# EAGLE design top_connector (EAGLE 9.7.0)
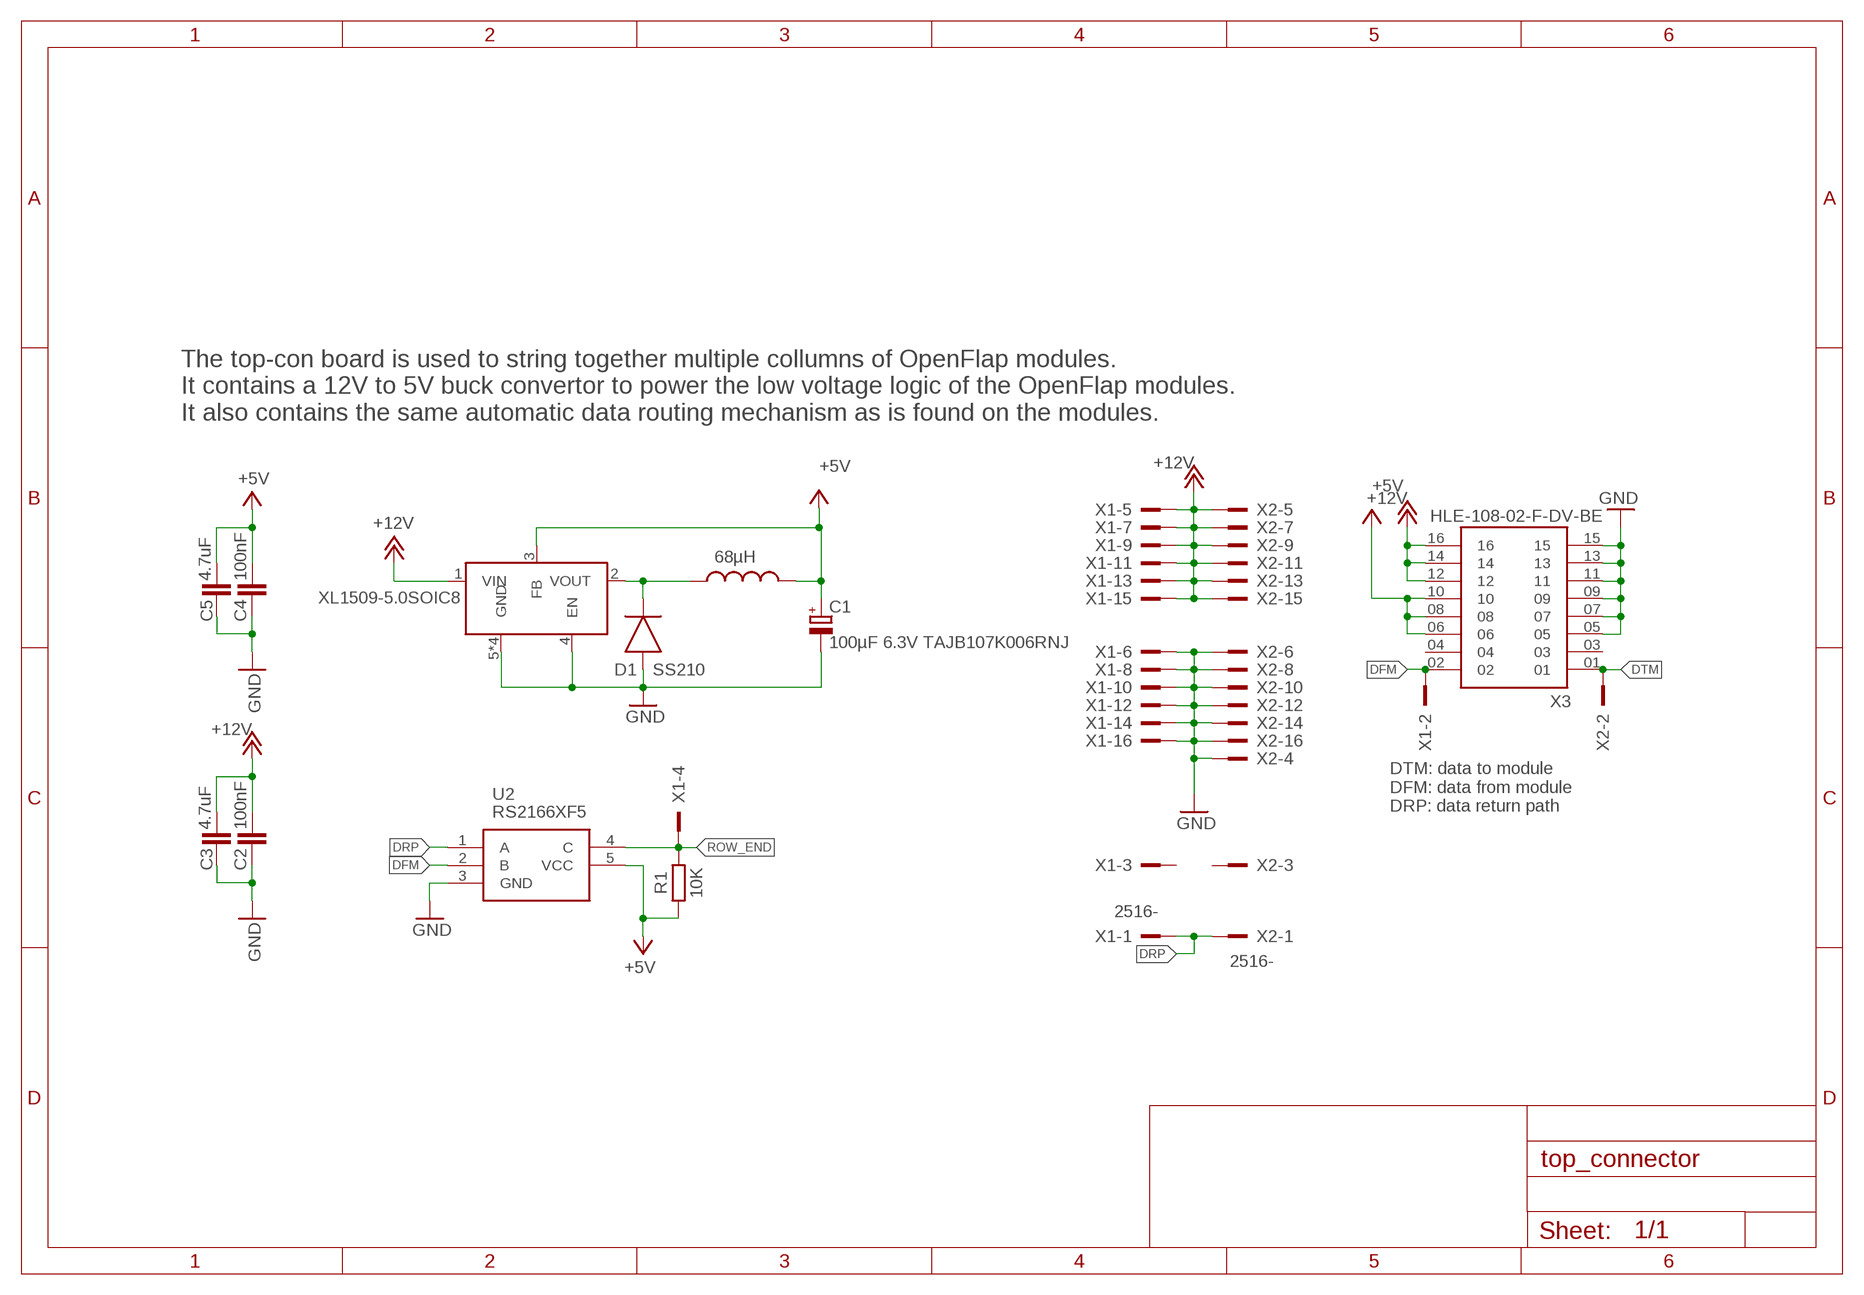
[diagram p0: schematic, sheet 1]

## Parts
C1  100µF 6.3V TAJB107K006RNJ  C-POL_TANTALUM-1411(3528-METRIC)  [CAPMP3528X210N]
C2  100nF  C_CHIP-0805(2012-METRIC)  [CAPC2012X110]
C3  4.7uF  C_CHIP-0805(2012-METRIC)  [CAPC2012X110]
C4  100nF  C_CHIP-0805(2012-METRIC)  [CAPC2012X110]
C5  4.7uF  C_CHIP-0805(2012-METRIC)  [CAPC2012X110]
D1  SS210  DIODEDO-214AC(SMA)  [DIOM5226X290N]
L1  SWPA6045S680MT  LVS606028-100M-N  [LVS606028-100M-N]
R1  10K  R_CHIP-0805(2012-METRIC)  [RESC2012X65]
U1  XL1509-5.0SOIC8  [SOIC8]
U2  RS2166XF5  SN74LVC1G66DBVR  [SOT95P280X145-5N]
X1  2516-  [PAK100/2500-16]
X2  2516-  [PAK100/2500-16]
X3  HLE-108-02-F-DV-BE  [SAMTEC_HLE-108-02-F-DV-BE]

## Nets
+5V: C1.1(+) C4.1 C5.1 L1.P$2 R1.1 U1.3(FB) U2.5(VCC) X3.06 X3.08 X3.10
+12V: C2.1 C3.1 U1.1(VIN) X1.5 X1.7 X1.9 X1.11 X1.13 X1.15 X2.5 X2.7 X2.9 X2.11 X2.13 X2.15 X3.12 X3.14 X3.16
DFM: U2.2(B) X1.2 X3.02
DRP: U2.1(A) X1.1 X2.1
DTM: X2.2 X3.01
GND: C1.2(-) C2.2 C3.2 C4.2 C5.2 D1.2(A) U1.4(EN) U1.5(GND) U1.6(GND) U1.7(GND) U1.8(GND) U2.3(GND) X1.6 X1.8 X1.10 X1.12 X1.14 X1.16 X2.4 X2.6 X2.8 X2.10 X2.12 X2.14 X2.16 X3.05 X3.07 X3.09 X3.11 X3.13 X3.15
N$2: D1.1(C) L1.P$1 U1.2(VOUT)
ROW_END: R1.2 U2.4(C) X1.4
Unconnected: X1.3 X2.3 X3.03 X3.04

## Notes on the sheet
- The top-con board is used to string together multiple collumns of OpenFlap modules.
  It contains a 12V to 5V buck convertor to power the low voltage logic of the OpenFlap modules.
  It also contains the same automatic data routing mechanism as is found on the modules.
- 68µH
- DTM: data to module
  DFM: data from module
  DRP: data return path

## Library data of the parts
C1 = Capacitor:C-POL: Capacitor Polarised - Generic; CATEGORY: Capacitor
C2-C5 = Capacitor:C: Capacitor - Generic; CATEGORY: Capacitor
D1 = Diode:DIODE: Diode Rectifier - Generic; CATEGORY: Diode; SUB-CATEGORY: Rectifier; VALUE: DIODE
L1 = TPMP1470GJ-Z:LVS606028-100M-N
R1 = Resistor:R: Resistor Fixed - Generic; CATEGORY: Resistor; SUB-CATEGORY: Fixed
U1 = TPMP1470GJ-Z:XL1509-5.0
U2 = SamacSys_Parts:SN74LVC1G66DBVR: SINGLE BILATERAL ANALOG SWITCH Source: Datasheet <http://www.ti.com/lit/gpn/sn74lvc1g66>; ARROW_PART_NUMBER: SN74LVC1G66DBVR; ARROW_PRICE-STOCK: https://www.arrow.com/en/products/sn74lvc1g66dbvr/texas-instruments; DESCRIPTION: SINGLE BILATERAL ANALOG SWITCH; HEIGHT: 1.45mm; MANUFACTURER_NAME: Texas Instruments; MANUFACTURER_PART_NUMBER: SN74LVC1G66DBVR; MOUSER_PART_NUMBER: 595-SN74LVC1G66DBVR; MOUSER_PRICE-STOCK: https://www.mouser.co.uk/ProductDetail/Texas-Instruments/SN74LVC1G66DBVR?qs=pt%2FIv5r0EPcNpRLTEQzKFQ%3D%3D
X1 X2 = con-3m:2516-: 3M (TM) Pak 100 4-Wall Header Source: 3M; OC_FARNELL: unknown; OC_NEWARK: unknown
X3 = HLE-108-02-F-DV-BE:HLE-108-02-F-DV-BE; MANUFACTURER: SAMTEC

## Board
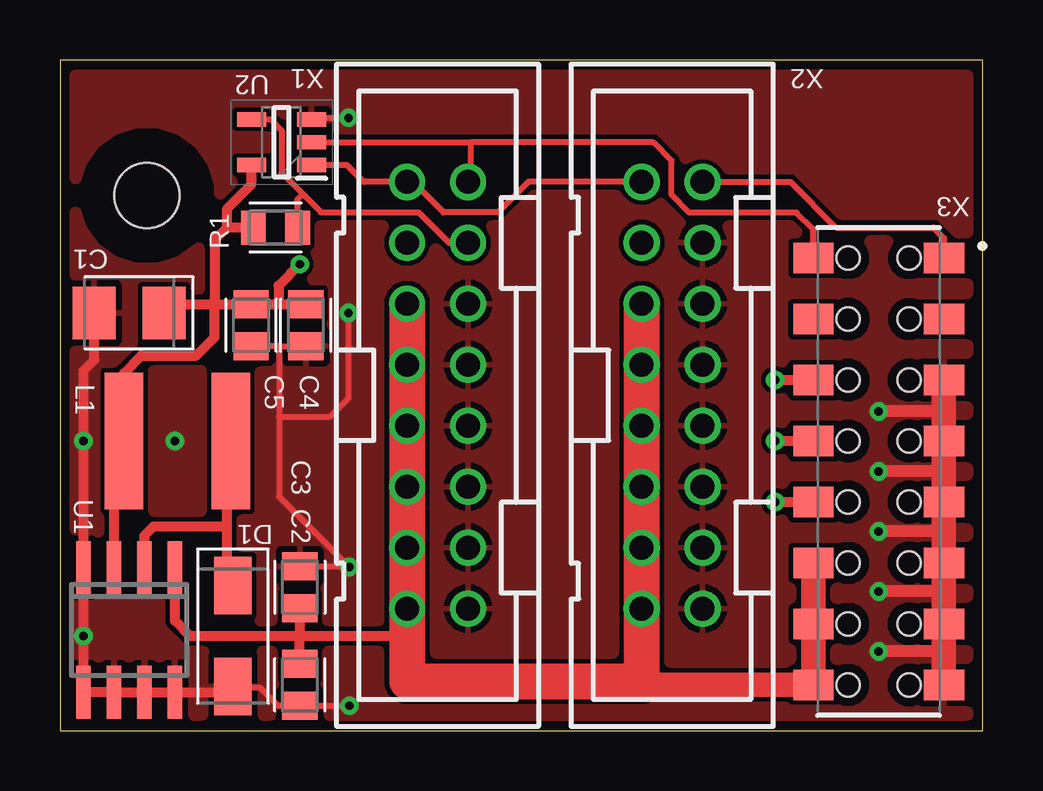
[diagram p1: board, top side]
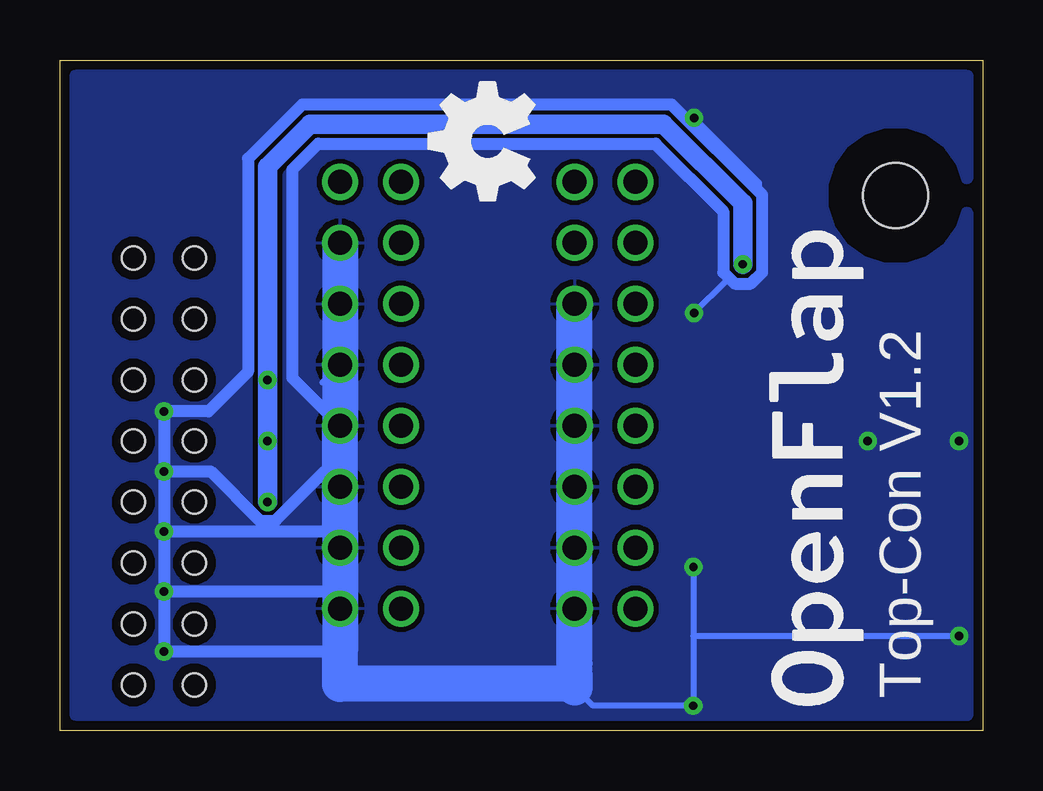
[diagram p2: board, bottom side, seen from below]

Size 38.46 x 27.94 mm. Coordinates in mm from the lower left corner, seen from the top.
Outline: 0,27.94 0,0 38.46,0 38.46,27.94 0,27.94
Copper layers (1*16): Top / Bottom
Stack-up Default Layer Stack: Top User Defined 0.035mm / Dielectric-1 User Defined 1.5mm / Bottom User Defined 0.035mm
Design rules "default *": minimum track width 6mil, minimum drill 0.35mm, track to track 6mil, track to pad 6mil, pad to pad 6mil, via to via 6mil, smd to smd 6mil, copper to edge 0.4mm, drill to drill 6mil, minimum pad ring 10mil, minimum via ring 8mil, stop-mask expansion 4mil, vias tented up to drill 0mil, thermal gap 10mil
Holes 2.7 mm at 3.63,22.3
tRestrict: area 1.6,20.3 to 5.6,24.3
bRestrict: area 1.6,20.3 to 5.6,24.3

### Footprints (pad centres in the part's own frame; a part is rotated, then mirrored left to right if it is on the bottom)
CAPMP3528X210N = smd 1.796 x 2.204: 1 -1.46,0; 2 1.46,0
CAPC2012X110 = smd 1.165 x 1.465: 1 -0.875,0; 2 0.875,0
DIOM5226X290N = smd 2.392 x 1.565: 1 -2.108,0; 2 2.108,0
LVS606028-100M-N = smd 5.7 x 1.6: P$1 0,-2.2; P$2 0,2.25
RESC2012X65 = smd 1.031 x 1.42: 1 -0.919,0; 2 0.919,0
SOIC8 = smd 0.6 x 2.2: 1 -1.905,-2.6; 2 -0.635,-2.6; 3 0.635,-2.6; 4 1.905,-2.6; 5 1.905,2.6; 6 0.635,2.6; 7 -0.635,2.6; 8 -1.905,2.6
SOT95P280X145-5N = smd 1.2 x 0.6: 1 -1.25,0.95; 2 -1.25,0; 3 -1.25,-0.95; 4 1.25,-0.95; 5 1.25,0.95
PAK100/2500-16 = drill 1 pad 1.422: 1 -8.89,-1.27; 2 -8.89,1.27; 3 -6.35,-1.27; 4 -6.35,1.27; 5 -3.81,-1.27; 6 -3.81,1.27; 7 -1.27,-1.27; 8 -1.27,1.27; 9 1.27,-1.27; 10 1.27,1.27; 11 3.81,-1.27; 12 3.81,1.27; 13 6.35,-1.27; 14 6.35,1.27; 15 8.89,-1.27; 16 8.89,1.27
SAMTEC_HLE-108-02-F-DV-BE = smd 1.27 x 1.68: 01 8.89,-2.72; 02 8.89,2.72; 03 6.35,-2.72; 04 6.35,2.72; 05 3.81,-2.72; 06 3.81,2.72; 07 1.27,-2.72; 08 1.27,2.72; 09 -1.27,-2.72; 10 -1.27,2.72; 11 -3.81,-2.72; 12 -3.81,2.72; 13 -6.35,-2.72; 14 -6.35,2.72; 15 -8.89,-2.72; 16 -8.89,2.72 | hole 0.97: 8.89,1.27; 8.89,-1.27; 6.35,1.27; 6.35,-1.27; 3.81,1.27; 3.81,-1.27; 1.27,1.27; 1.27,-1.27; -1.27,1.27; -1.27,-1.27; -3.81,1.27; -3.81,-1.27; -6.35,1.27; -6.35,-1.27; -8.89,1.27; -8.89,-1.27

### Placement (x,y rotation side)
C1  2.89,17.4 180 top
C2  10,1.9 270 top
C3  10,5.97 90 top
C4  10.25,16.89 270 top
C5  7.97,16.89 270 top
D1  7.2,3.94 270 top
L1  4.92,12.06 90 top
R1  8.98,20.95 0 top
U1  2.89,4.19 180 top
U2  9.24,24.51 180 top
X1  15.74,13.97 270 top
X2  25.52,13.97 270 top
X3  34.13,10.79 90 top

### Tracks (layer width: path | path; a pad name or v marks a point on that pad's centre or on a via)
+5V  (via drill 0.35)
  Top 0.406: U1.3 2.25,11.65 L1.P$2 2.67,14.89 3.39,15.62 5.68,15.62 6.44,16.38 6.44,17.77 | 4.35,17.08 C1.1 4.71,17.77 6.44,17.77 | 6.44,17.77 C5.1 9.11,17.77 | R1.1 6.95,20.95 | 6.95,20.95 6.44,20.45 6.44,17.77 | 9.11,17.77 C4.1 | X3.06 v29.81,14.61 | v29.81,9.53 X3.10 | X3.08 v29.81,12.06 | v10,19.43 9.11,18.54 9.11,17.77 | U2.5 7.97,23.54 7.97,22.73 6.95,21.72 6.95,20.95
  Bottom 0.813: v29.81,9.53 v29.81,12.06 v29.81,14.61 29.81,23.49 28.03,25.27 13.3,25.27 10,21.97 v10,19.43
+12V
  Top 0.406: 14.47,3.94 10,3.94 | 10,3.94 6.95,3.94 5.43,3.94 4.79,4.57 U1.1 | C3.1 10,3.94 | C2.1 10,3.94
  Top 0.508: 31.41,4.29 X3.12 | 14.47,5.35 X1.15 14.18,4.79
  Top 1.016: 31.41,4.29 X3.16 24.25,1.9 | X3.14 X3.12 | 24.25,1.9 24.25,1.79 | 24.25,1.9 24.25,2.92
  Top 1.5: X2.11 24.25,10.29 | X1.5 X1.7 X1.9 X1.11 X1.13 X1.15 14.47,3.94 14.47,2.05 24.25,2.05 24.25,2.92 X2.15 X2.13 X2.11 | X2.5 X2.7 X2.9 X2.11
  Bottom 0.508: 24.25,10.46 X2.11
DFM
  Top 0.254: U2.2 17.11,24.51 | X3.02 31.41,20.88 30.7,21.59 26.23,21.59 25.49,22.32 25.49,23.75 24.73,24.51 17.11,24.51 | 17.11,24.51 17.11,22.96 X1.2
DRP
  Top 0.254: U2.1 11.96,23.56 12.67,22.86 X1.1 14.72,22.86 15.99,21.59 18.26,21.59 19.52,22.86 X2.1
DTM
  Top 0.254: X2.2 30.45,22.86 32.35,20.95 36.41,20.95 36.85,20.52 X3.01
GND  (via drill 0.35)
  Top 0.254: 7.16,1.79 8.34,1.79 9.1,1.03 C2.2 v12.06,1.03 v12.07,1.04 | C3.2 12.03,6.84 | 12.03,6.84 v12.06,6.81 | 9.13,16.02 C4.2 | 9.13,16.02 C5.2 | 9.13,16.02 9.13,13.08 | 9.13,13.08 9.13,9.74 12.03,6.84 | U2.3 10.55,25.53 v12.03,25.53 | v12.03,17.4 12.03,13.84 11.27,13.08 9.13,13.08
  Top 0.406: 7.16,1.79 6.97,1.59 U1.8 U1.7 U1.6 U1.5 v0.98,3.94 0.98,6.15 | U1.4 v0.98,12.06 0.98,14.99 1.43,15.43 C1.2
  Top 0.508: 36.85,5.79 X3.11 36.85,8.29 | 36.85,5.79 X3.13 36.85,3.29 | 36.85,3.29 X3.15 | 36.85,8.29 X3.09 36.85,10.79 | 36.85,10.79 X3.07 36.85,13.29 | X3.05 36.85,13.29 | 36.85,13.29 v34.13,13.29 | 36.85,3.29 v34.13,3.29 | 36.85,5.79 v34.13,5.79 | 36.85,8.29 v34.13,8.29 | 36.85,10.79 v34.13,10.79 | D1.2 7.16,1.79 7.16,1.48
  Top 1.016: X3.15 X3.13 X3.11 X3.05
  Bottom 0.254: 27.4,9.54 X2.12 | 27.39,12.1 X2.10 | 27.53,14.5 X2.8 | 17.01,1.79 16.25,1.04 v12.07,1.04 v12.06,1.04 12.06,3.94 | v12.06,6.81 12.06,3.94 | v0.98,3.94 12.06,3.94 | v12.03,17.4 10.68,18.75 9.71,18.75 9.31,19.15 9.31,22.81 v12.03,25.53
  Bottom 0.508: v34.13,10.79 v34.13,13.29 32.27,13.29 30.62,14.94 30.62,23.83 28.37,26.09 12.96,26.09 9.19,22.31 9.19,19.09 9.66,18.62 10.34,18.62 10.81,19.09 10.81,21.63 13.64,24.46 27.7,24.46 28.77,23.38 28.77,14.68 X2.10 | v34.13,10.79 v34.13,8.29 | v34.13,8.29 v34.13,5.79 | v34.13,5.79 v34.13,3.29 26.79,3.29 | v34.13,5.79 26.79,5.79 | v34.13,8.29 26.79,8.29 | 16.51,2.79 17.01,2.29 | v34.13,10.79 32.19,10.79 30.14,8.74 29.49,8.74 27.43,10.79 26.79,10.79
  Bottom 1.5: 17.01,1.95 17.01,2.29 X1.16 X1.14 X1.12 X1.10 X1.8 X1.6 | 17.01,1.95 17.01,1.79 | 17.01,1.95 26.79,1.95 26.79,3.29 X2.16 26.79,5.79 X2.14 26.79,8.29 X2.12 26.79,10.79 X2.10 X2.8 X2.6 X2.4
  other vias: 4.79,12.06
  pour Top (isolate 0.2): -0.66,28.3 38.63,28.3 38.63,-0.21 -0.66,-0.21
  pour Bottom (isolate 0.2): -1.16,28.3 -1.16,-0.21 39.63,-0.21 39.63,28.3
N$2
  Top 0.254: D1.1 6.95,6.3
  Top 0.406: U1.2 3.52,8.13 3.9,8.51 6.95,8.51 | 6.95,8.51 6.95,6.3 | L1.P$1 6.95,11.9 6.95,8.51
ROW_END
  Top 0.254: U2.4 8.79,25.46 9.24,25.02 9.24,23.24 10.13,22.35 | 10.13,22.35 10.88,21.59 14.95,21.59 16.22,20.32 X1.4 | R1.2 9.9,22.13 10.13,22.35

### Text on the board
bPlace: Top-Con V1.2
tNames: X1 | X3 | L1